# EAGLE schematic circuit (EAGLE 7.5.0)
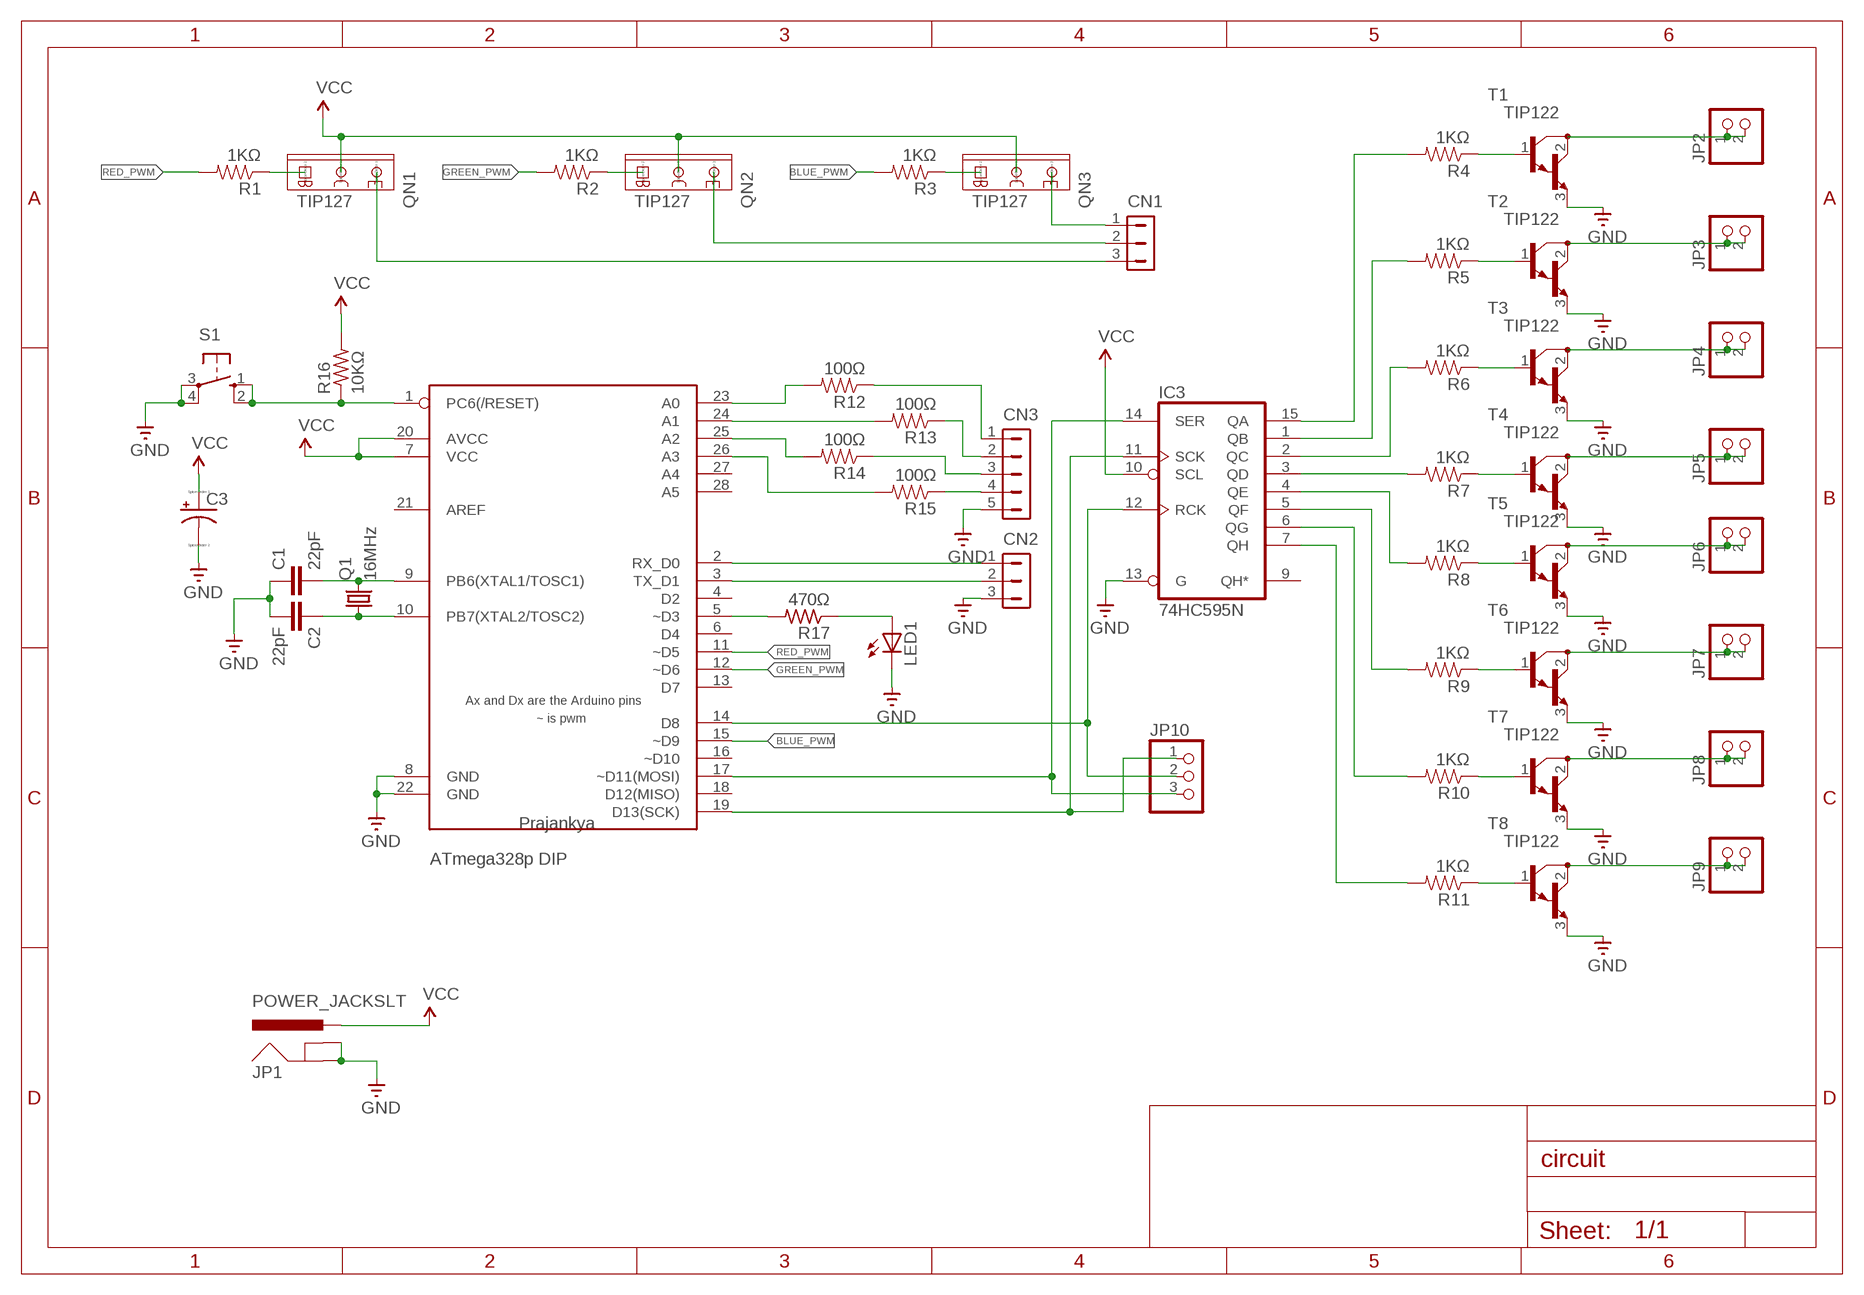
[diagram p0: schematic, sheet 1]

## Parts
C1  22pF  C-EU025-025X050  [C025-025X050]
C2  22pF  C-EU025-025X050  [C025-025X050]
C3  CPOL-USTT2D6L  [TT2D6L]
CN1  HDR-1X3-70543-?  [70543-03]
CN2  HDR-1X3-70543-?  [70543-03]
CN3  HDR-1X5-70543-?  [70543-05]
IC3  74HC595N  [DIL16]
JP1  POWER_JACKSLT  [POWER_JACK_SLOT]
JP2  PINHD-1X2  [1X02]
JP3  PINHD-1X2  [1X02]
JP4  PINHD-1X2  [1X02]
JP5  PINHD-1X2  [1X02]
JP6  PINHD-1X2  [1X02]
JP7  PINHD-1X2  [1X02]
JP8  PINHD-1X2  [1X02]
JP9  PINHD-1X2  [1X02]
JP10  PINHD-1X3  [1X03]
LED1  LED5MM  [LED5MM]
Q1  16MHz  CRYSTALHC49U-V  [HC49U-V]
QN1  TIP127  [TO220AV]
QN2  TIP127  [TO220AV]
QN3  TIP127  [TO220AV]
R1  1KΩ  RESISTORPTH-1/4W  [AXIAL-0.4]
R2  1KΩ  RESISTORPTH-1/4W  [AXIAL-0.4]
R3  1KΩ  RESISTORPTH-1/4W  [AXIAL-0.4]
R4  1KΩ  RESISTORPTH-1/4W  [AXIAL-0.4]
R5  1KΩ  RESISTORPTH-1/4W  [AXIAL-0.4]
R6  1KΩ  RESISTORPTH-1/4W  [AXIAL-0.4]
R7  1KΩ  RESISTORPTH-1/4W  [AXIAL-0.4]
R8  1KΩ  RESISTORPTH-1/4W  [AXIAL-0.4]
R9  1KΩ  RESISTORPTH-1/4W  [AXIAL-0.4]
R10  1KΩ  RESISTORPTH-1/4W  [AXIAL-0.4]
R11  1KΩ  RESISTORPTH-1/4W  [AXIAL-0.4]
R12  100Ω  RESISTORPTH-1/4W  [AXIAL-0.4]
R13  100Ω  RESISTORPTH-1/4W  [AXIAL-0.4]
R14  100Ω  RESISTORPTH-1/4W  [AXIAL-0.4]
R15  100Ω  RESISTORPTH-1/4W  [AXIAL-0.4]
R16  10KΩ  R-US_0207/10  [0207/10]
R17  470Ω  R-US_0207/12  [0207/12]
S1  10-XX  [B3F-10XX]
T1  TIP122  [TO220]
T2  TIP122  [TO220]
T3  TIP122  [TO220]
T4  TIP122  [TO220]
T5  TIP122  [TO220]
T6  TIP122  [TO220]
T7  TIP122  [TO220]
T8  TIP122  [TO220]
U$1  ATMEGA328P_DIP  [ATMEGA328_CUSTOMPAD]

## Nets
BLUE_PWM: R3.P$2 U$1.15(~D9)
GND: C1.1 C2.2 C3.- CN2.3 CN3.5 IC3.13(G) JP1.GND@1(GNDBREAK) JP1.GND@2(GND) LED1.K(C) S1.3(P) S1.4(P1) T1.3(E) T2.3(E) T3.3(E) T4.3(E) T5.3(E) T6.3(E) T7.3(E) T8.3(E) U$1.8(GND) U$1.22(GND)
GREEN_PWM: R2.P$2 U$1.12(~D6)
N1: JP2.1 JP2.2 T1.2(C)
N2: JP3.1 JP3.2 T2.2(C)
N3: JP4.1 JP4.2 T3.2(C)
N4: JP5.1 JP5.2 T4.2(C)
N5: JP6.1 JP6.2 T5.2(C)
N6: JP7.1 JP7.2 T6.2(C)
N7: JP8.1 JP8.2 T7.2(C)
N8: JP9.1 JP9.2 T8.2(C)
N$1: CN1.3 QN1.E
N$2: CN1.2 QN2.E
N$3: CN1.1 QN3.E
N$4: QN1.B R1.P$1
N$5: QN2.B R2.P$1
N$6: QN3.B R3.P$1
N$7: R4.P$1 T1.1(B)
N$8: R5.P$1 T2.1(B)
N$9: R12.P$2 U$1.23(A0)
N$10: IC3.15(QA) R4.P$2
N$11: R13.P$2 U$1.24(A1)
N$12: IC3.1(QB) R5.P$2
N$13: R6.P$1 T3.1(B)
N$14: R14.P$2 U$1.25(A2)
N$15: IC3.2(QC) R6.P$2
N$16: R7.P$1 T4.1(B)
N$17: R15.P$2 U$1.26(A3)
N$18: IC3.3(QD) R7.P$2
N$19: R8.P$1 T5.1(B)
N$20: CN2.1 U$1.2(RX_D0)
N$21: IC3.4(QE) R8.P$2
N$22: R9.P$1 T6.1(B)
N$23: CN2.2 U$1.3(TX_D1)
N$24: IC3.5(QF) R9.P$2
N$25: R10.P$1 T7.1(B)
N$26: R17.2 U$1.5(~D3)
N$27: IC3.6(QG) R10.P$2
N$28: R11.P$1 T8.1(B)
N$29: LED1.A R17.1
N$30: IC3.7(QH) R11.P$2
N$31: IC3.11(SCK) JP10.1 U$1.19(D13(SCK))
N$32: IC3.12(RCK) JP10.2 U$1.14(D8)
N$37: C2.1 Q1.1 U$1.10(PB7(XTAL2/TOSC2))
N$38: C1.2 Q1.2 U$1.9(PB6(XTAL1/TOSC1))
N$41: CN3.1 R12.P$1
N$42: CN3.2 R13.P$1
N$43: CN3.3 R14.P$1
N$44: CN3.4 R15.P$1
N$45: IC3.14(SER) JP10.3 U$1.17(~D11(MOSI))
N$48: R16.1 S1.1(S) S1.2(S1) U$1.1(PC6(/RESET))
RED_PWM: R1.P$2 U$1.11(~D5)
VCC: C3.+ IC3.10(SCL) JP1.PWR QN1.C QN2.C QN3.C R16.2 U$1.7(VCC) U$1.20(AVCC)
Unconnected: IC3.9(QH*) U$1.4(D2) U$1.6(D4) U$1.13(D7) U$1.16(~D10) U$1.18(D12(MISO)) U$1.21(AREF) U$1.27(A4) U$1.28(A5)

## Power pins joined to a net without a drawn wire
GND: IC3.8(GND)
VCC: IC3.16(VCC)

## Library data of the parts
C1 C2 = rcl:C-EU: CAPACITOR, European symbol
C3 = resistor:CPOL-US: POLARIZED CAPACITOR, American symbol
CN1 CN2 = con-hdrs40:HDR-1X3: HEADER CONNECTOR
CN3 = con-hdrs40:HDR-1X5: HEADER CONNECTOR
IC3 = 74xx-eu:74*595: 8-bit SHIFT REGISTER, output latch
JP1 = SparkFun-Connectors:POWER_JACK: Power Jack This is the standard 5.5mm barrel jack for power. The PTH is the most common, proven, reliable, footprint. The Slot footprint only works if the mill layer is transmitted to the PCB fab house so be warned. Mating wall wart : TOL-00298 (and others); PROD_ID: PRT-00119
JP2-JP9 = pinhead:PINHD-1X2: PIN HEADER
JP10 = pinhead:PINHD-1X3: PIN HEADER
LED1 = adafruit:LED: LED OSRAM: - CHIPLED LG R971, LG N971, LY N971, LG Q971, LY Q971, LO R971, LY R971 LH N974, LH R974 LS Q976, LO Q976, LY Q976 LO Q996 - Hyper CHIPLED LW Q18S LB Q993, LB Q99A, LB R99A - SideLED LS A670, LO A670, LY A670, LG A670, LP A670 LB A673, LV A673, LT A673, LW A673 LH A674 LY A675 LS A676, LA A676, LO A676, LY A676, LW A676 LS A679, LY A679, LG A679 - Hyper Micro SIDELED® LS Y876, LA Y876, LO Y876, LY Y876 LT Y87S - SmartLED LW L88C, LW L88S LB L89C, LB L89S, LG L890 LS L89K, LO L89K, LY L89K LS L896, LA L896, LO L896, LY L896 - TOPLED LS T670, LO T670, LY T670, LG T670, LP T670 LSG T670, LSP T670, LSY T670, LOP T670, LYG T670 LG T671, LOG T671, LSG T671 LB T673, LV T673, LT T673, LW T673 LH T674 LS T676, LA T676, LO T676, LY T676, LB T676, LH T676, LSB T676, LW T676 LB T67C, LV T67C, LT T67C, LS T67K, LO T67K, LY T67K, LW E67C LS E67B, LA E67B, LO E67B, LY E67B, LB E67C, LV E67C, LT E67C LW T67C LS T679, LY T679, LG T679 LS T770, LO T770, LY T770, LG T770, LP T770 LB T773, LV T773, LT T773, LW T773 LH T774 LS E675, LA E675, LY E675, LS T675 LS T776, LA T776, LO T776, LY T776, LB T776 LHGB T686 LT T68C, LB T68C - Hyper Mini TOPLED® LB M676 - Mini TOPLED Santana® LG M470 LS M47K, LO M47K, LY M47K Source: http://www.osram.convergy.de/
Q1 = crystal:CRYSTAL: CRYSTAL; OC_FARNELL: 1666969; OC_NEWARK: unknown
QN1-QN3 = PAsystem:TIP127: TO-220
R1-R15 = SparkFun-Resistors:RESISTOR: Resistor Basic schematic elements and footprints for 0603, 1206, and PTH resistors.
R16 R17 = rcl:R-US_: RESISTOR, American symbol
S1 = switch-omron:10-XX: OMRON SWITCH; MPN: B3F-1000; OC_FARNELL: 176432; OC_NEWARK: 36M3542
T1-T8 = transistor:TIP122: NPN BIPOLAR DARLINGTON TRANSISTOR
U$1 = prajankya:ATMEGA328P_DIP: ATmega328p in DIP package with ARDUINO pinout by Prajankya

## Net classes
0 default: width 1.016 mm, clearance 0.61 mm
1 Power_VHC: width 1.778 mm, clearance 1.016 mm
2 Gnd_VHC: width 2.032 mm, clearance 1.016 mm